# Altium schematic sheet MCU.SchDoc
size A4
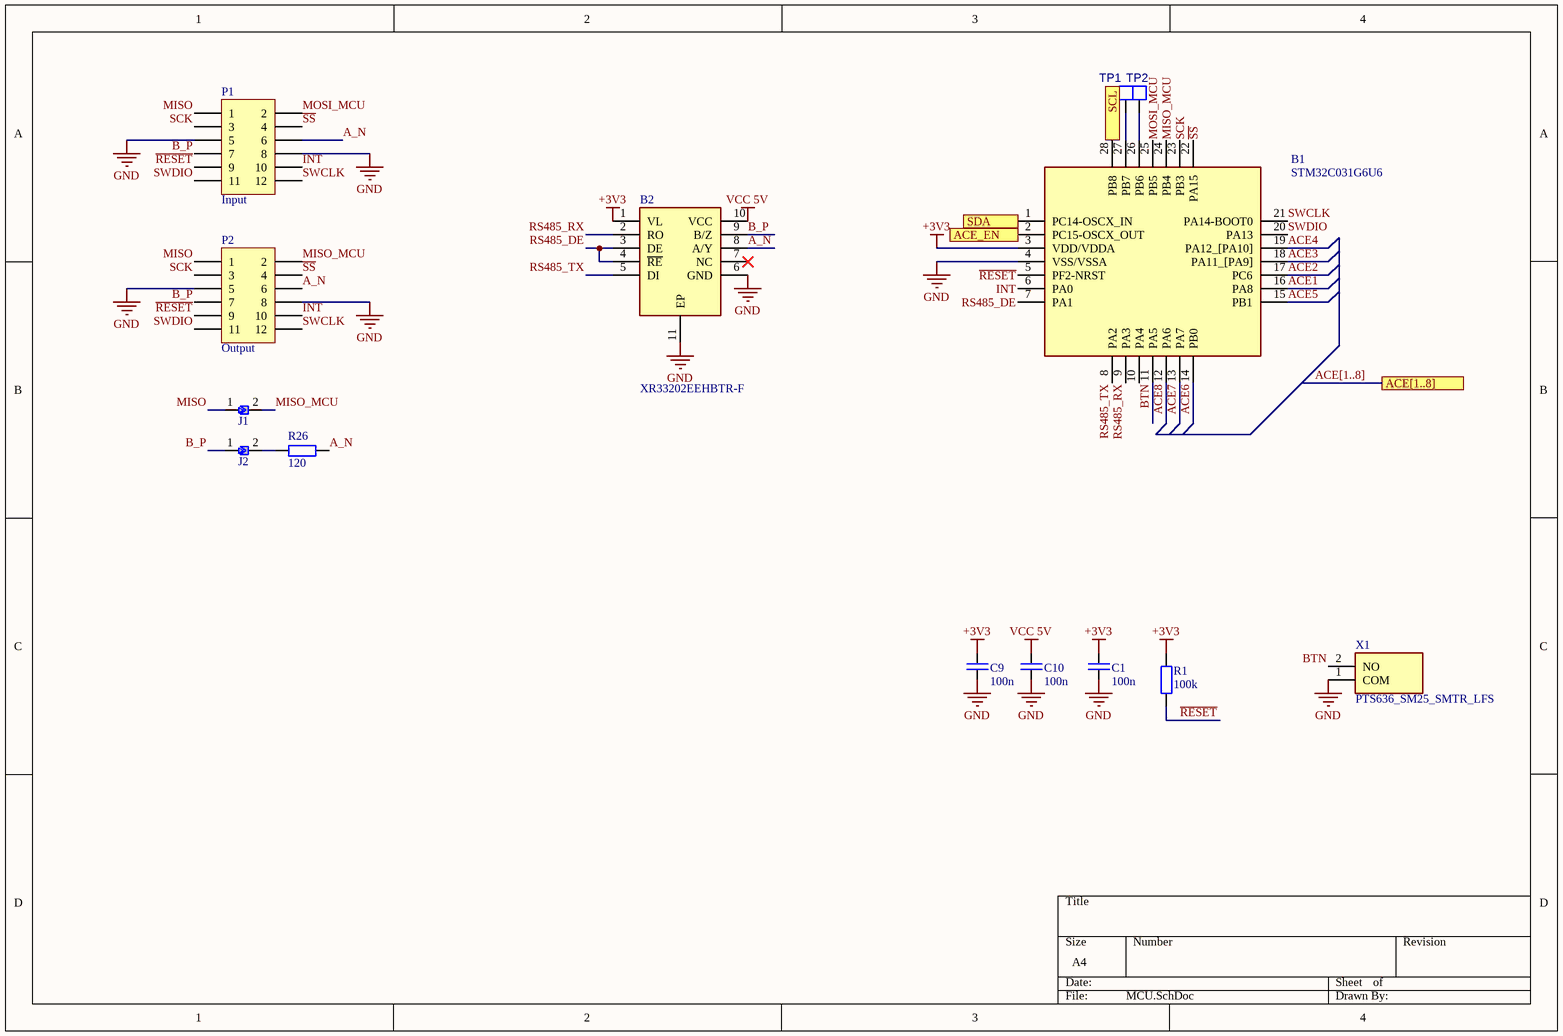
[diagram p0: MCU.SchDoc]

## Parts
B1  STM32C031G6U6  [QFN50P400X400X60-28N-D]
B2  XR33202EEHBTR-F  [SON50P300X300X80-11N-D]
C1  100n  [R1005_0402i_L]
C9  100n  [R1005_0402i_L]
C10  100n  [R1005_0402i_L]
J1  solder_jumper  [solder_jumper_triangle]  (value not drawn)
J2  solder_jumper  [solder_jumper_triangle]  (value not drawn)
P1  Input  [1.27mm SMD conn]
P2  Output  [1.27mm SMD conn]
R1  100k  [R1005_0402i_L]
R26  120  [R1005_0402i_L]
TP1  PAD  [PAD]  (value not drawn)
TP2  PAD  [PAD]  (value not drawn)
X1  PTS636_SM25_SMTR_LFS  [PTS636SM25SMTRLFS]

## Ports
ACE[1..8], ACE_EN, SCL, SDA

## Nets
+3V3: B1.3(VDD/VDDA) B2.1(VL) C1.1 C9.1 R1.1
GND: B1.4(VSS/VSSA) B2.6(GND) B2.11(EP) C1.2 C9.2 C10.2 P1.5 P1.8 P2.5 P2.8 X1.1(COM)
VCC 5V: B2.10(VCC) C10.1
A_N: B2.8(A/Y) P1.6 P2.6 R26.2
ACE1: B1.16(PA8)
ACE2: B1.17(PC6)
ACE3: B1.18(PA11_[PA9])
ACE4: B1.19(PA12_[PA10])
ACE5: B1.15(PB1)
ACE6: B1.14(PB0)
ACE7: B1.13(PA7)
ACE8: B1.12(PA6)
ACE_EN: B1.2(PC15-OSCX_OUT) ; port ACE_EN
B_P: B2.9(B/Z) J2.1 P1.7 P2.7
BTN: B1.11(PA5) X1.2(NO)
INT: B1.6(PA0) P1.10 P2.10
MISO: J1.1 P1.1 P2.1
MISO_MCU: B1.24(PB4) J1.2 P2.2
MOSI_MCU: B1.25(PB5) P1.2
~{RESET}: B1.5(PF2-NRST) P1.9 P2.9 R1.2
RS485_DE: B1.7(PA1) B2.3(DE) B2.4(~{RE})
RS485_RX: B1.9(PA3) B2.2(RO)
RS485_TX: B1.8(PA2) B2.5(DI)
~{SS}: B1.22(PA15) P1.4 P2.4
SCK: B1.23(PB3) P1.3 P2.3
SCL: B1.28(PB8) ; port SCL
SDA: B1.1(PC14-OSCX_IN) ; port SDA
SWCLK: B1.21(PA14-BOOT0) P1.12 P2.12
SWDIO: B1.20(PA13) P1.11 P2.11
NetB1_26: B1.26(PB6) TP2.1
NetB1_27: B1.27(PB7) TP1.1
NetJ2_2: J2.2 R26.1

Not connected (* = marked no-connect by the designer): B1 10(PA4); B2 7(NC)*

## Buses and harness runs
bus ACE[1..8] = port ACE[1..8]

## Library data of the parts
B1 = STM32C031G6U6: Mainstream Arm Cortex-M0+ MCU with 32 Kbytes of Flash memory, 12 Kbytes RAM, 48 MHz CPU, 2x USART, timers, ADC, comm. I/F, 2-3.6V; Manufacturer_Name: STMicroelectronics; Geometry.Height: 0.6mm; Mouser Part Number: 511-STM32C031G6U6; Mouser Price/Stock: https://www.mouser.co.uk/ProductDetail/STMicroelectronics/STM32C031G6U6?qs=IPgv5n7u5QZqRf3nOTChhw%3D%3D; Manufacturer_Part_Number: STM32C031G6U6; Datasheet Link: https://www.st.com/resource/en/datasheet/stm32c031c4.pdf
B2 = XR33202EEHBTR-F: RS-422/RS-485 Interface IC Wide Supply Trans with I/O Interface; Manufacturer_Name: MaxLinear, Inc.; Geometry.Height: 0.8mm; Mouser Part Number: 701-XR33202EEHBTR-F; Mouser Price/Stock: https://www.mouser.co.uk/ProductDetail/MaxLinear/XR33202EEHBTR-F?qs=GtWAI9k6EVi4nRW8bj1LFw%3D%3D; Manufacturer_Part_Number: XR33202EEHBTR-F; Datasheet Link: https://www.maxlinear.com/ds/xr33202.pdf
C1 C9 C10 = C: Capacitor
P1 P2 = Header 6X2: Header, 6-Pin, Dual row; LatestRevisionDate: 17-Jul-2002; LatestRevisionNote: Re-released for DXP Platform.; Publisher: Altium Limited
R1 R26 = R
X1 = PTS636_SM25_SMTR_LFS: Tactile Switches Tact 50mA 12VDC, 6.0x3.5, 2.5mm H, 180gf, G leads, No ground pin, White Actuator; Manufacturer_Name: C & K COMPONENTS; Manufacturer_Part_Number: PTS636 SM25 SMTR LFS; Geometry.Height: 2.7mm; Mouser Part Number: 611-PTS636SM25SMTRLF; Mouser Price/Stock: https://www.mouser.co.uk/ProductDetail/CK/PTS636-SM25-SMTR-LFS?qs=vLWxofP3U2yIXR4iooxesw%3D%3D; Datasheet Link: https://componentsearchengine.com/Datasheets/1/PTS636 SM25 SMTR LFS.pdf